# EAGLE design ultrasonic (EAGLE 7.2.0)
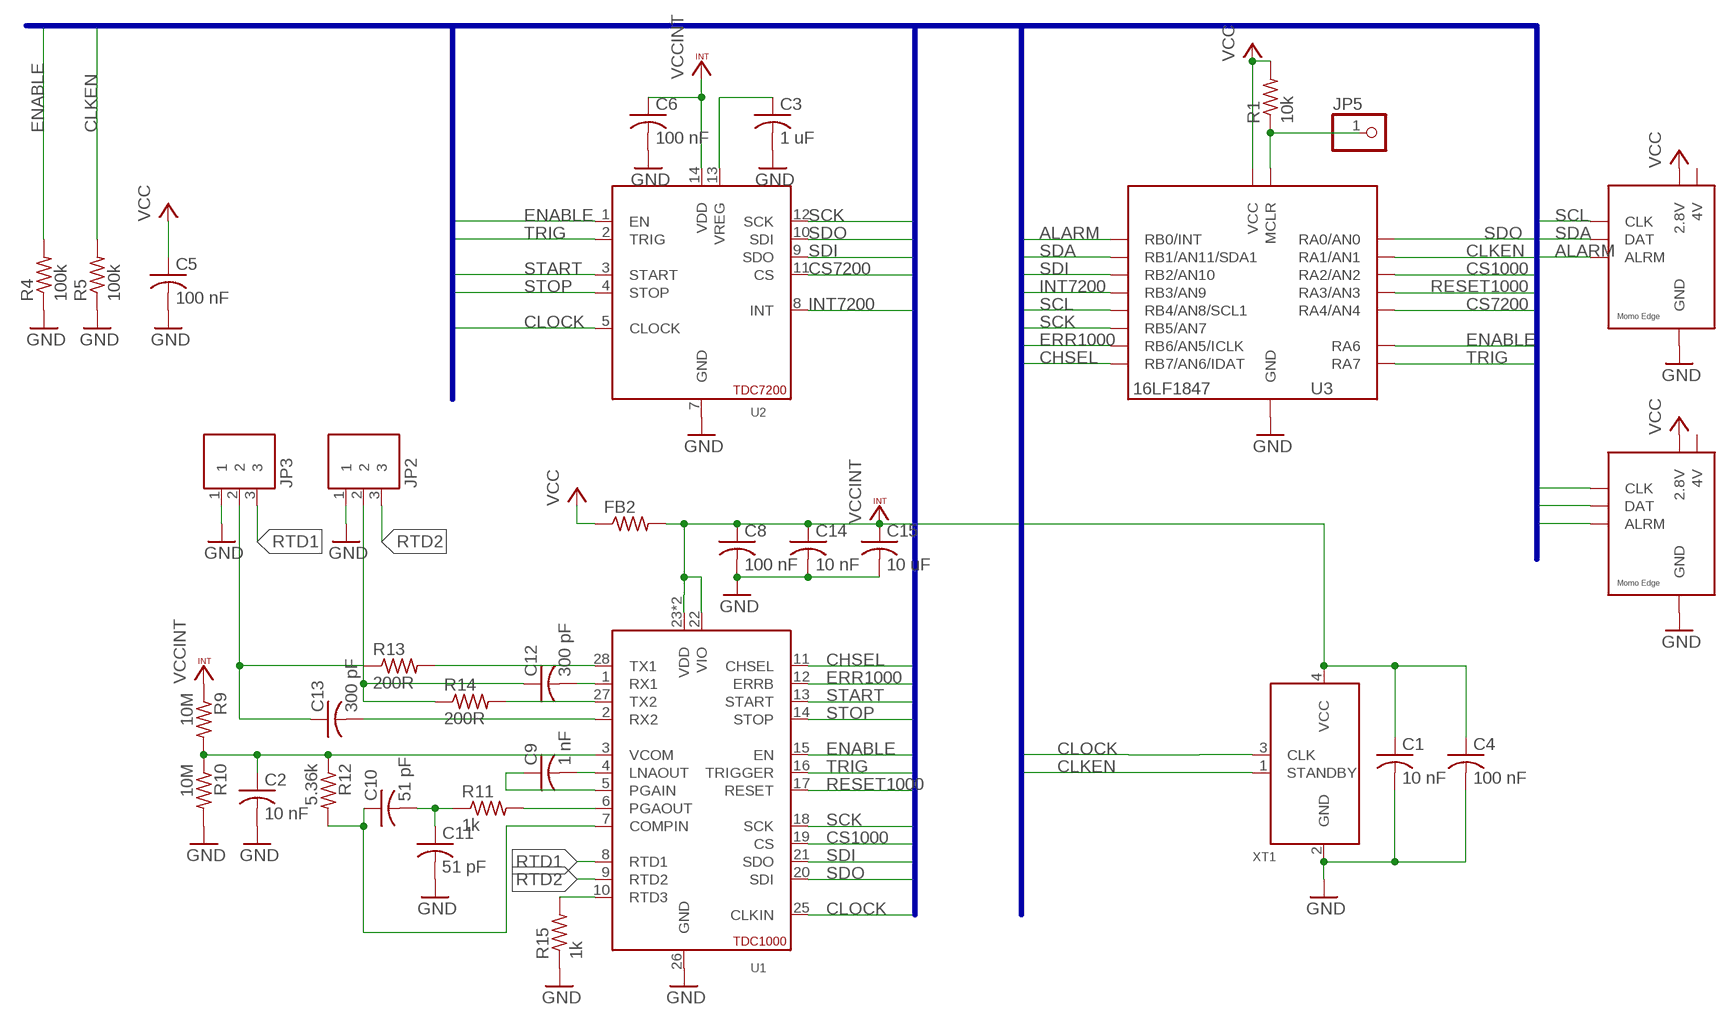
[diagram p0: schematic, sheet 1]

## Parts
C1  10 nF  C-USC0402  [C0402]
C2  10 nF  C-USC0402  [C0402]
C3  1 uF  C-USC0402  [C0402]
C4  100 nF  C-USC0402  [C0402]
C5  100 nF  C-USC0402  [C0402]
C6  100 nF  C-USC0402  [C0402]
C8  100 nF  C-USC0402  [C0402]
C9  1 nF  C-USC0402  [C0402]
C10  51 pF  C-USC0402  [C0402]
C11  51 pF  C-USC0402  [C0402]
C12  300 pF  C-USC0402  [C0402]
C13  300 pF  C-USC0402  [C0402]
C14  10 nF  C-USC0402  [C0402]
C15  10 uF  C-USC0805K  [C0805K]
FB2  R-US_R0603  [R0603]
JP1  MOMO-VERT-6M  [1X06]
JP2  JST-PH-3PIN  [JST-PH-3PIN]
JP3  JST-PH-3PIN  [JST-PH-3PIN]
JP4  MOMO-EDGE-6M-RIGHT  [MOMO-EDGE-6M]
JP5  PINHD-1X1  [1X01]
R1  10k  R-US_R0402  [R0402]
R4  100k  R-US_R0402  [R0402]
R5  100k  R-US_R0402  [R0402]
R9  10M  R-US_R0402  [R0402]
R10  10M  R-US_R0402  [R0402]
R11  1k  R-US_R0402  [R0402]
R12  5.36k  R-US_R0402  [R0402]
R13  200R  R-US_R0402  [R0402]
R14  200R  R-US_R0402  [R0402]
R15  1k  R-US_R0402  [R0402]
U1  TDC1000  [TSSOP28]
U2  TDC7200  [TSSOP14]
U3  PIC16LF1847  [SSOP20]
XT1  MEMS-OSCILLATOR  [4-DFN]

## Nets
ALARM: JP1.5(ALRM) JP4.DAT(ALRM) U3.7(RB0/INT)
CHSEL: U1.11(CHSEL) U3.14(RB7/AN6/IDAT)
CLKEN: R5.2 U3.20(RA1/AN1) XT1.1(STANDBY)
CLOCK: U1.25(CLKIN) U2.5(CLOCK) XT1.3(CLK)
CS1000: U1.19(CS) U3.1(RA2/AN2)
CS7200: U2.11(CS) U3.3(RA4/AN4)
ENABLE: R4.2 U1.15(EN) U2.1(EN) U3.17(RA6)
ERR1000: U1.12(ERRB) U3.13(RB6/AN5/ICLK)
GND: C1.2 C2.2 C3.2 C4.2 C5.2 C6.2 C8.2 C11.2 C14.2 C15.2 JP1.7(GND) JP2.1 JP3.1 JP4.V28(GND) R4.1 R5.1 R10.2 R15.1 U1.26(GND) U2.7(GND) U3.5(GND) U3.6(GND) XT1.2(GND)
INT7200: U2.8(INT) U3.10(RB3/AN9)
N$4: C3.1 U2.13(VREG)
N$6: C9.2 U1.4(LNAOUT)
N$9: JP5.1 R1.1 U3.4(MCLR)
N$10: C2.1 R9.2 R10.1 R12.1 U1.3(VCOM)
N$11: C9.1 U1.5(PGAIN)
N$12: C10.2 C11.1 R11.1
N$13: R11.2 U1.6(PGAOUT)
N$14: C10.1 R12.2 U1.7(COMPIN)
N$15: C13.1 JP3.2 R13.1
N$16: R14.2 U1.27(TX2)
N$17: R13.2 U1.28(TX1)
N$18: C12.2 U1.1(RX1)
N$19: C13.2 U1.2(RX2)
N$20: C12.1 JP2.2 R14.1
N$21: R15.2 U1.10(RTD3)
RESET1000: U1.17(RESET) U3.2(RA3/AN3)
RTD1: JP3.3 U1.8(RTD1)
RTD2: JP2.3 U1.9(RTD2)
SCK: U1.18(SCK) U2.12(SCK) U3.12(RB5/AN7)
SCL: JP1.3(CLK) JP4.4V(CLK) U3.11(RB4/AN8/SCL1)
SDA: JP1.4(DAT) JP4.ALARM(DAT) U3.8(RB1/AN11/SDA1)
SDI: U1.21(SDO) U2.9(SDO) U3.9(RB2/AN10)
SDO: U1.20(SDI) U2.10(SDI) U3.19(RA0/AN0)
START: U1.13(START) U2.3(START)
STOP: U1.14(STOP) U2.4(STOP)
TRIG: U1.16(TRIGGER) U2.2(TRIG) U3.18(RA7)
VCC: C5.1 FB2.1 JP1.1(2.8V) JP4.GND(2.8V) R1.2 U3.15(VCC) U3.16(VCC)
VCCINT: C1.1 C4.1 C6.1 C8.1 C14.1 C15.1 FB2.2 R9.1 U1.22(VIO) U1.23(VDD) U1.24(VDD) U2.14(VDD) XT1.4(VCC)

## Buses
COMMS:SDA,SCL,ALARM,SDO,SDI,CS1000,CS7200,ENABLE,SCK,START,STOP,CLOCK,TRIG,CLKEN,CHSEL,ERR1000,RESET1000,INT7200

## Power pins joined to a net without a drawn wire
4V: JP1.6(4V) JP4.CLK(4V)

## Library data of the parts
C1 C2 C14 = rcl:C-US: CAPACITOR, American symbol; DIGIKEY-PN: 490-4516-1-ND
C3 = rcl:C-US: CAPACITOR, American symbol; DIGIKEY-PN: 490-3890-1-ND
C4-C6 C8 = rcl:C-US: CAPACITOR, American symbol; DIGIKEY-PN: 490-1318-1-ND
C9 = rcl:C-US: CAPACITOR, American symbol; DIGIKEY-PN: 490-6349-1-ND
C10 C11 = rcl:C-US: CAPACITOR, American symbol; DIGIKEY-PN: 490-5944-1-ND
C12 C13 = rcl:C-US: CAPACITOR, American symbol; DIGIKEY-PN: 490-3234-1-ND
C15 = rcl:C-US: CAPACITOR, American symbol; DIGIKEY-PN: 490-10516-1-ND
FB2 = rcl:R-US_: RESISTOR, American symbol
JP1 = components:MOMO-VERT-6M
JP2 JP3 = custom_ics:JST-PH-3PIN; DESCRIPTION: 3-pin JST PH Series Vertical Shrouded Connector; DIST: Digikey; DIST-PN: 455-1705-ND; FOOTPRINT: Through Hole
JP4 = components:MOMO-EDGE-6M-RIGHT
JP5 = pinhead:PINHD-1X1: PIN HEADER
R1 = rcl:R-US_: RESISTOR, American symbol; DIGIKEY-PN: RHM10.0KCDCT-ND
R4 R5 = rcl:R-US_: RESISTOR, American symbol; DIGIKEY-PN: RHM100KCDCT-ND
R9 R10 = rcl:R-US_: RESISTOR, American symbol; DIGIKEY-PN: 1276-3434-1-ND
R11 = rcl:R-US_: RESISTOR, American symbol; DIGIKEY-PN: RHM1.00KCDCT-ND
R12 = rcl:R-US_: RESISTOR, American symbol; DIGIKEY-PN: RHM5.36KCDCT-ND
R13 R14 = rcl:R-US_: RESISTOR, American symbol; DIGIKEY-PN: 311-200LRCT-ND
R15 = rcl:R-US_: RESISTOR, American symbol; DIGIKEY-PN: P1.0KDCCT-ND
U1 = custom_ics:TDC1000: TDC1000 Ultrasonic Analog Frontend; DESCRIPTION: TI TDC1000 Ultrasonic Analog Frontend; DIST: Digikey; DIST-PN: 296-38823-1-ND; FOOTPRINT: TSSOP28; MANU: Texas Instruments; MPN: TDC1000PW
U2 = custom_ics:TDC7200: TI TDC7200 Time to Digital Converter; DESCRIPTION: TI TDC7200 Picosecond Time to Digital Converter; DIST: Digikey; DIST-PN: 296-41125-5-ND; FOOTPRINT: TSSOP14; MANU: Texas Instruments; MPN: TDC7200PW
U3 = components:PIC16LF1847; DESCRIPTION: PIC16LF1847 8-bit microcontroller; DIGIKEY-PN: PIC16LF1847-I/SS-ND
XT1 = custom_ics:MEMS-OSCILLATOR

## Board
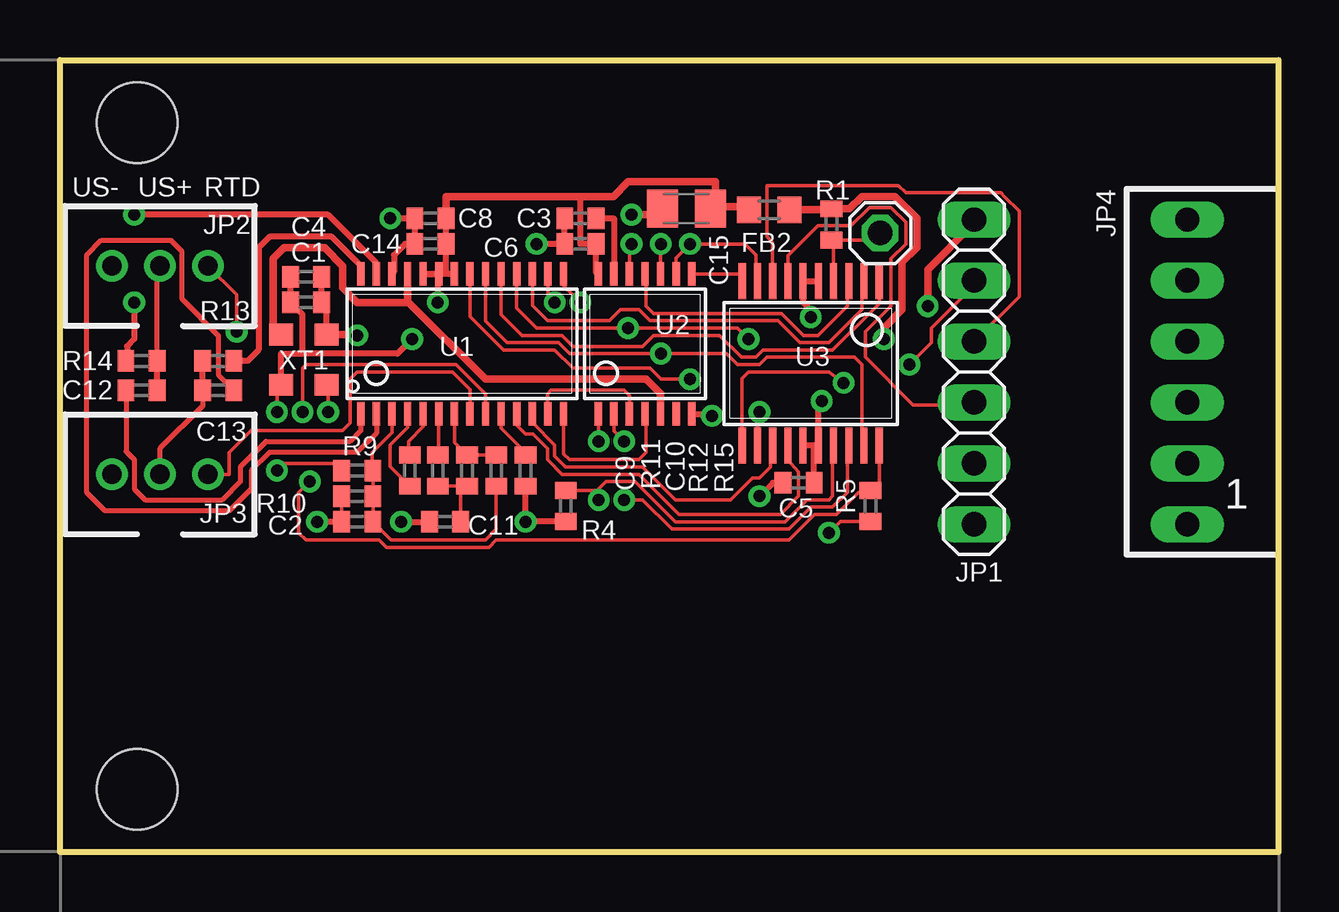
[diagram p1: board, top side]
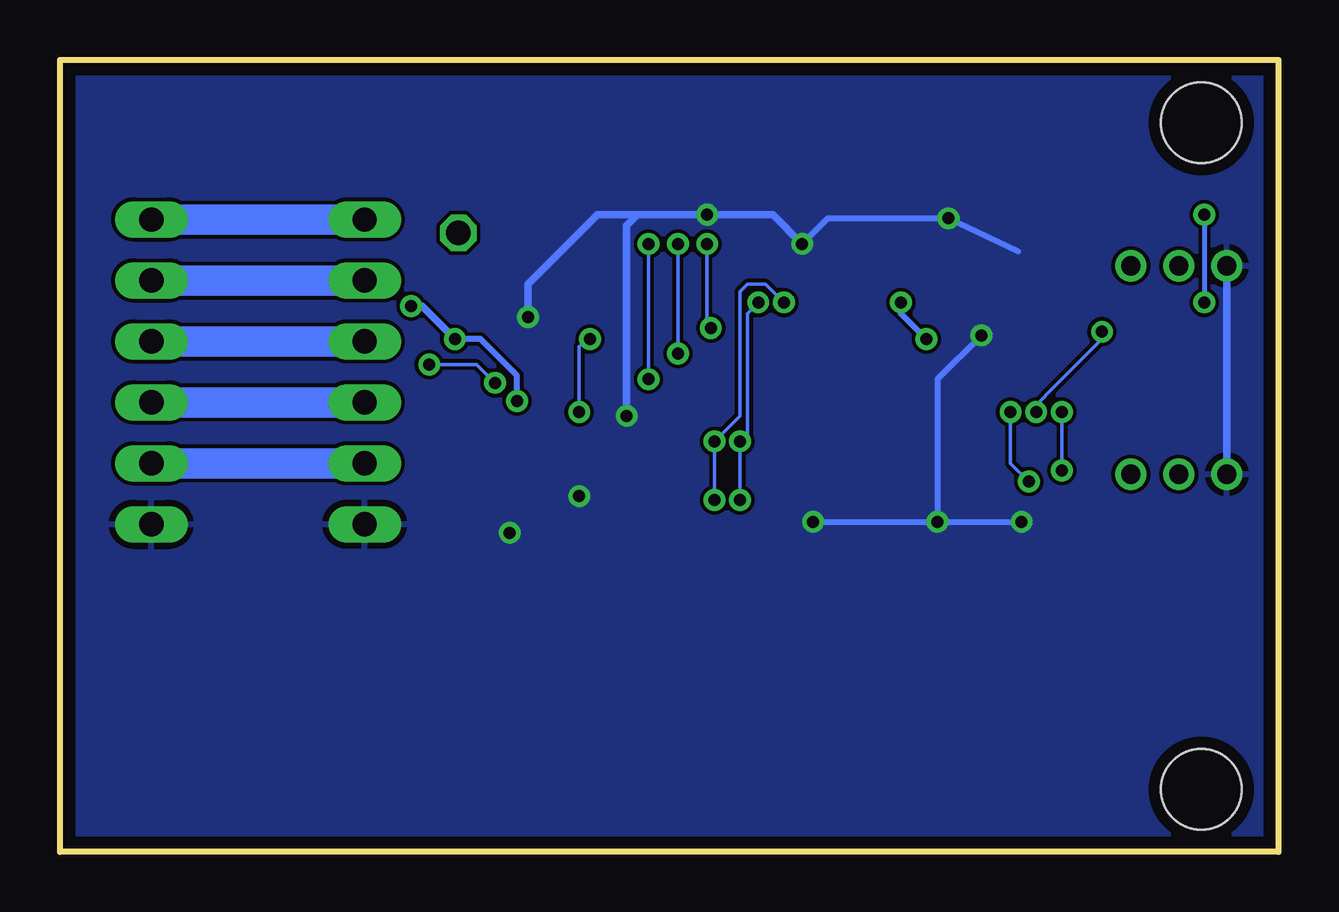
[diagram p2: board, bottom side, seen from below]

Size 50.8 x 33.02 mm. Coordinates in mm from the lower left corner, seen from the top.
Outline: 0,0 0,33.02 50.8,33.02 50.8,0 0,0
Copper layers (1*16): Top 0.035mm / dielectric 1.5mm / Bottom 0.035mm
Design rules "default *": minimum track width 6mil, minimum drill 15mil, track to track 6mil, track to pad 6mil, pad to pad 6mil, via to via 6mil, smd to smd 6mil, copper to edge 20mil, drill to drill 8mil, minimum pad ring 10mil, minimum via ring 8mil, stop-mask expansion 4mil, vias tented up to drill 0mil, thermal gap 10mil
Holes 3.35 mm at 3.23,2.62 3.23,30.4

### Footprints (pad centres in the part's own frame; a part is rotated, then mirrored left to right if it is on the bottom)
C0402 = smd 0.7 x 0.9: 1 -0.65,0; 2 0.65,0
C0805K = smd 1.3 x 1.6: 1 -1,0; 2 1,0
R0603 = smd 1 x 1.1: 1 -0.85,0; 2 0.85,0
1X06 = drill 1.016 long: 1 -8.89,0; 3 -6.35,0; 4 -3.81,0; 5 -1.27,0; 6 1.27,0; 7 3.81,0
JST-PH-3PIN = drill 0.8: 1 -2,0; 2 0,0; 3 2,0
MOMO-EDGE-6M = drill 1.016 long: 4V 0,0; ALARM 0,2.54; CLK 0,7.62; DAT 0,5.08; GND 0,-2.54; V28 0,10.16
1X01 = drill 1.016 octagon: 1 0,0
R0402 = smd 0.7 x 0.9: 1 -0.65,0; 2 0.65,0
TSSOP28 = smd 0.305 x 0.991: 1 -4.225,-2.918; 2 -3.575,-2.918; 3 -2.925,-2.918; 4 -2.275,-2.918; 5 -1.625,-2.918; 6 -0.975,-2.918; 7 -0.325,-2.918; 8 0.325,-2.918; 9 0.975,-2.918; 10 1.625,-2.918; 11 2.275,-2.918; 12 2.925,-2.918; 13 3.575,-2.918; 14 4.225,-2.918; 15 4.225,2.918; 16 3.575,2.918; 17 2.925,2.918; 18 2.275,2.918; 19 1.625,2.918; 20 0.975,2.918; 21 0.325,2.918; 22 -0.325,2.918; 23 -0.975,2.918; 24 -1.625,2.918; 25 -2.275,2.918; 26 -2.925,2.918; 27 -3.575,2.918; 28 -4.225,2.918
TSSOP14 = smd 0.305 x 0.991: 1 -1.95,-2.918; 2 -1.3,-2.918; 3 -0.65,-2.918; 4 0,-2.918; 5 0.65,-2.918; 6 1.3,-2.918; 7 1.95,-2.918; 8 1.95,2.918; 9 1.3,2.918; 10 0.65,2.918; 11 0,2.918; 12 -0.65,2.918; 13 -1.3,2.918; 14 -1.95,2.918
SSOP20 = smd 0.3 x 1.5: 1 -2.857,-3.431; 2 -2.222,-3.431; 3 -1.587,-3.431; 4 -0.952,-3.431; 5 -0.317,-3.431; 6 0.318,-3.431; 7 0.953,-3.431; 8 1.588,-3.431; 9 2.223,-3.431; 10 2.858,-3.431; 11 2.858,3.431; 12 2.219,3.431; 13 1.588,3.431; 14 0.953,3.431; 15 0.318,3.431; 16 -0.317,3.431; 17 -0.952,3.431; 18 -1.587,3.431; 19 -2.222,3.431; 20 -2.857,3.431
4-DFN = smd 0.9 x 1: 1 -1.05,-0.95; 2 1.05,-0.95; 3 1.05,0.95; 4 -1.05,0.95

### Placement (x,y rotation side)
C1  10.26,22.91 0 top
C2  12.4,13.77 180 top
C3  21.69,26.42 180 top
C4  10.26,23.98 0 top
C5  30.78,15.39 180 top
C6  21.69,25.35 180 top
C8  15.44,26.42 180 top
C9  14.58,15.9 270 top
C10  16.97,15.9 270 top
C11  16.05,13.77 180 top
C12  3.4,19.25 180 top
C13  6.6,19.25 0 top
C14  15.44,25.35 180 top
C15  26.11,26.82 180 top
FB2  29.57,26.77 180 top
JP1  38.1,17.48 270 top
JP2  4.17,24.43 0 top
JP3  4.17,15.75 0 top
JP4  46.99,23.83 180 top
JP5  34.19,25.81 0 top
R1  32.16,26.16 90 top
R4  21.08,14.43 90 top
R5  33.78,14.43 90 top
R9  12.4,15.9 0 top
R10  12.4,14.83 180 top
R11  15.75,15.9 90 top
R12  18.19,15.9 90 top
R13  6.6,20.47 0 top
R14  3.4,20.47 180 top
R15  19.41,15.9 90 top
U1  16.76,21.18 0 top
U2  24.38,21.18 0 top
U3  31.29,20.37 180 top
XT1  10.16,20.52 90 top

### Tracks (layer width: path | path; a pad name or v marks a point on that pad's centre or on a via)
4V
  Bottom 1.27: JP1.6 JP4.CLK
ALARM
  Top 0.152: U3.7 30.34,24.85 30.99,25.5 31.6,26.11 32.97,26.11 33.73,26.87 34.65,26.87 35.25,26.26 35.25,25.35 34.65,24.74 34.65,22.76 33.58,21.69 33.58,20.63 35.56,18.64 35.86,18.64 36.17,18.64 37.39,18.64 37.49,18.75 JP1.5
  Bottom 1.27: JP1.5 JP4.DAT
CHSEL
  Top 0.152: U1.11 19.04,17.79 19.41,17.42 19.71,17.42 20.32,16.82 20.32,16.36 20.93,15.75 24.13,15.75 25.81,14.07 30.02,14.07 30.78,14.83 30.78,15.85 30.34,16.35 U3.14
CLKEN  (via drill 0.5)
  Top 0.152: XT1.1 11.18,19.47 v11.18,18.34 | U3.20 34.15,16.75 34.15,15.45 R5.2 33.69,14.99 33.27,14.99 32.36,14.07 31.45,14.07 30.38,13.01 18.19,13.01 17.88,12.7 13.61,12.7 13.31,13.01 10.26,13.01 9.96,13.31 9.96,14.99 v10.41,15.44
  Bottom 0.152: v11.18,18.34 11.18,16.21 v10.41,15.44
CLOCK
  Top 0.305: U2.5 25.03,19.11 24.44,19.71 17.73,19.71 14.49,22.95 | 14.49,22.95 U1.25 | 14.49,22.95 14.45,22.91 12.4,22.91 11.79,23.52 11.79,24.44 11.02,25.2 9.35,25.2 8.89,24.74 8.89,24.28 8.89,21.89 XT1.3
CS1000
  Top 0.152: U1.19 18.39,22.4 19.25,21.54 20.93,21.54 21.39,21.08 24.28,21.08 24.74,21.54 27.48,21.54 28.4,20.63 29.01,20.63 29.31,20.93 32.21,20.93 33.69,22.42 34.15,22.87 U3.1
CS7200
  Top 0.152: U2.11 24.44,24.05 24.44,22.76 24.74,22.45 30.07,22.45 30.99,21.54 31.6,21.54 32.82,22.76 32.82,23.74 U3.3
ENABLE  (via drill 0.5)
  Top 0.152: U2.1 22.45,18.25 v22.45,17.12 | R4.2 22.45,15.08 v22.45,14.68 22.45,15.14 22.76,15.44 23.98,15.44 25.65,13.77 30.23,13.77 31.14,14.68 32.05,14.68 32.21,14.83 32.21,16.9 U3.17 | U1.15 20.99,23.61 v21.69,22.91
  Bottom 0.152: v22.45,14.68 v22.45,17.12 22.15,17.42 22.15,22.45 v21.69,22.91
ERR1000
  Top 0.152: U1.12 19.69,17.9 20.62,16.97 20.62,16.51 21.08,16.05 24.28,16.05 25.65,14.68 27.94,14.68 28.85,15.6 29.16,15.6 29.62,16.05 29.62,16.85 U3.13
GND  (via drill 0.5)
  Top 0.152: C2.2 R10.2 | R5.1 32.52,13.78 v32.05,13.31
  Top 0.254: v14.22,13.77 C11.2 | R15.1 v19.41,13.77 v19.42,13.78 R4.1 | C2.2 v10.72,13.77 | U2.7 27.1,18.27 v27.18,18.19 | v19.86,25.35 C6.2 C3.2 | U1.26 13.92,24.18 13.92,24.89 14.38,25.35 C14.2 C8.2 v13.77,26.42 | C5.2 29.72,15.39 v29.16,14.83 | U3.5 U3.6 30.99,23.79 30.99,22.91 31.29,22.61 v31.29,22.3 | XT1.2 11.11,22.71 C1.2 C4.2
  Top 0.305: v23.83,26.57 25.01,26.57 C15.2 | XT1.2 12.36,21.57 v12.4,21.54
  Bottom 0.254: v19.41,13.77 v14.22,13.77 | v14.22,13.77 v10.72,13.77 | 10.87,25.04 v13.77,26.42 18.8,26.42 v19.86,25.35 | v12.4,21.54 14.22,19.71 v14.22,13.77
  Bottom 0.305: JP3.1 JP2.1 | 24.89,26.57 21.08,26.57 v19.86,25.35 | v31.29,22.3 31.29,23.67 28.4,26.57 26.72,26.57 | 26.72,26.57 v23.83,26.57 | v27.18,18.19 27.18,26.11 26.72,26.57
  pour Bottom: 0.05,32.97 50.8,32.97 50.8,0.05 0.05,0.05
INT7200
  Top 0.152: U3.10 28.43,24.1 U2.8
N$4
  Top 0.254: C3.1 23.08,26.42 U2.13
N$6
  Top 0.152: U1.4 14.49,17.69 13.77,16.97 13.77,16.06 C9.2
N$9
  Top 0.152: U3.4 32.24,25.42 R1.1 33.89,25.51 JP5.1
N$10
  Top 0.152: U1.3 13.84,17.5 13.01,16.66 13.01,15.94 R9.2 R10.1 C2.1 13.81,13.01 17.73,13.01 18.19,13.46 R12.1
N$11
  Top 0.152: U1.5 15.14,17.73 14.53,17.12 14.53,16.6 C9.1
N$12
  Top 0.152: R11.1 C10.2 16.7,14.99 C11.1
N$13
  Top 0.152: U1.6 15.79,16.59 R11.2
N$14
  Top 0.152: U1.7 16.44,17.08 C10.1 R12.2
N$15
  Top 0.203: C13.1 5.95,18.6 4.17,16.82 JP3.2
  Top 0.254: C13.1 R13.1
N$16  (via drill 0.5)
  Top 0.254: v3.1,22.91 3.1,21.39 2.79,21.08 2.79,20.51 R14.2 | U1.27 13.16,24.13 13.16,24.59 11.18,26.57 v3.1,26.57
  Bottom 0.203: v3.1,26.57 v3.1,22.91
N$17
  Top 0.254: U1.28 12.54,24.44 11.33,25.65 8.74,25.65 8.28,25.2 8.28,20.93 7.82,20.47 R13.2 | 7.25,20.82 R13.2 | 7.25,20.51 R13.2
N$18
  Top 0.203: U1.1 12.54,17.57 12.09,17.12 8.58,17.12 7.52,16.05 7.52,15.44 6.76,14.68 3.56,14.68 3.1,15.14 3.1,16.36 2.75,16.7 C12.2
N$19
  Top 0.203: U1.2 13.19,17.46 12.4,16.66 8.74,16.66 7.98,15.9 7.98,15.14 7.06,14.22 1.88,14.22 1.12,14.99 1.12,24.89 1.73,25.5 4.62,25.5 5.08,25.04 5.08,23.06 6.6,21.54 6.6,19.9 C13.2
N$20
  Top 0.203: R14.1 4.05,24.32 JP2.2
  Top 0.254: C12.1 R14.1
N$21
  Top 0.152: U1.10 18.39,17.68 19.41,16.66 R15.2
RESET1000
  Top 0.152: U1.17 19.69,22.78 20.32,22.15 22.91,22.15 23.37,22.61 24.13,22.61 24.59,22.15 29.92,22.15 30.84,21.23 32.05,21.23 33.43,22.61 33.43,23.71 U3.2
RTD1
  Top 0.152: U1.8 17.09,19.28 16.36,20.02 12.4,20.02 12.09,19.71 12.09,17.88 11.79,17.58 7.98,17.58 7.06,16.66 7.06,15.75 JP3.3
RTD2  (via drill 0.5)
  Top 0.152: U1.9 17.74,19.09 16.51,20.32 10.26,20.32 10.11,20.17 10.11,18.95 10.11,18.49 v10.11,18.34 | v7.37,21.69 7.37,23.23 JP2.3
  Bottom 0.152: v10.11,18.34 10.11,18.64 9.35,19.41 7.37,21.39 v7.37,21.69
SCK  (via drill 0.5)
  Top 0.152: U1.18 19.04,22.67 19.86,21.84 v23.67,21.84 28.24,21.84 v28.7,21.39 | v23.83,25.35 23.73,25.26 U2.12 | v29.16,18.34 29.07,18.25 U3.12
  Bottom 0.152: v23.83,25.35 23.83,22 v23.67,21.84 | v28.7,21.39 29.16,21.08 v29.16,18.34
SCL  (via drill 0.5)
  Top 0.152: U3.11 28.43,19.75 28.7,20.02 32.05,20.02 v32.66,19.56 | v35.41,20.32 36.32,21.23 36.32,21.84 38.1,23.62 JP1.3
  Bottom 0.152: v32.66,19.56 33.43,20.32 v35.41,20.32
  Bottom 1.27: JP4.4V JP1.3
SDA
  Top 0.152: U3.8 29.7,25.41 29.46,25.65 29.46,27.58 29.46,27.79 32.21,27.79 34.95,27.79 35.25,27.48 39.22,27.48 39.37,27.33 39.98,26.72 39.98,23.67 39.98,23.17 JP1.4
  Bottom 1.27: JP4.ALARM JP1.4
SDI  (via drill 0.5)
  Top 0.152: U1.21 17.09,22.33 18.49,20.93 20.62,20.93 21.39,20.17 24.59,20.17 25.04,19.71 v26.26,19.71 | U2.9 25.68,24.77 v26.26,25.35 28.55,25.35 29.01,24.89 29.01,23.87 U3.9
  Bottom 0.152: v26.26,19.71 v26.26,25.35
SDO  (via drill 0.5)
  Top 0.152: U1.20 17.74,22.14 18.64,21.23 20.78,21.23 21.23,20.78 v25.04,20.78 27.79,20.78 28.24,20.32 29.16,20.32 29.46,20.63 33.12,20.63 33.43,20.32 33.43,17.03 U3.19 | v25.04,25.35 25.03,25.34 U2.10
  Bottom 0.152: v25.04,20.78 v25.04,25.35
START
  Top 0.152: U2.3 23.73,19.04 23.52,19.25 20.47,19.25 20.32,19.1 20.32,18.29 U1.13
STOP
  Top 0.152: U1.14 20.99,16.6 21.23,16.36 24.13,16.36 24.44,16.66 24.44,18.22 U2.4
TRIG  (via drill 0.5)
  Top 0.152: U2.2 23.08,17.56 v23.52,17.12 | U1.16 20.34,23.2 v20.62,22.91 | v23.52,14.68 24.28,14.68 25.5,13.46 30.38,13.46 31.29,14.38 32.21,14.38 32.82,14.99 32.82,16.88 U3.18
  Bottom 0.152: v23.52,14.68 v23.52,17.12 22.45,18.19 22.45,23.37 22.15,23.67 21.39,23.67 v20.62,22.91
VCC  (via drill 0.5)
  Top 0.254: U3.16 U3.15 | C5.1 31.43,16.82 U3.16 | U3.16 31.61,18.66 v31.75,18.8
  Top 0.305: FB2.1 32.12,26.77 R1.2 32.91,26.81 33.43,27.33 34.8,27.33 35.71,26.42 35.71,25.2 35.1,24.59 35.1,22.61 34.34,21.84 v34.34,21.39 | v36.17,22.76 36.17,24.28 38.1,26.21 JP1.1
  Bottom 0.254: v31.75,18.8 31.75,19.86 33.27,21.39 v34.34,21.39
  Bottom 0.305: v34.34,21.39 35.71,22.76 v36.17,22.76
  Bottom 1.27: JP4.GND JP1.1
VCCINT  (via drill 0.5)
  Top 0.152: R9.1 11.44,16.21 9.35,16.21 v9.04,15.9 | 9.21,20.17 9.21,20.02 | v9.04,18.34 9.04,19.31 XT1.4
  Top 0.254: U2.14 22.34,24.19 C6.1 21.69,25.35 21.69,27.33 | C8.1 C14.1 16.09,24.1 U1.22 U1.23 U1.24 15.75,24.1 v15.75,22.91 | C4.1 C1.1 10.11,22.41 10.11,20.78 | XT1.4 9.21,20.02 9.21,20.78 10.11,20.78 | v14.68,21.39 14.07,20.78 10.11,20.78
  Top 0.305: 27.47,26.77 C15.1 | C15.1 27.48,26.91 28.73,26.91 FB2.2 | C8.1 16.09,27.33 21.69,27.33 23.06,27.33 23.67,27.94 27.33,27.94 27.33,27.04 C15.1
  Bottom 0.152: v9.04,18.34 v9.04,15.9
  Bottom 0.254: v15.75,22.91 15.75,22.45 v14.68,21.39

### Text on the board
tPlace: US- | US+ | RTD
tDocu: Ultrasonic Sensor Module / Version 1.0 / 5/7/2015